# Altium schematic sheet WITH_MIC.SchDoc: ESP32 + INMP441 WLED SHIELD
size A; Revision: 1; SheetNumber: 1; SheetTotal: 2
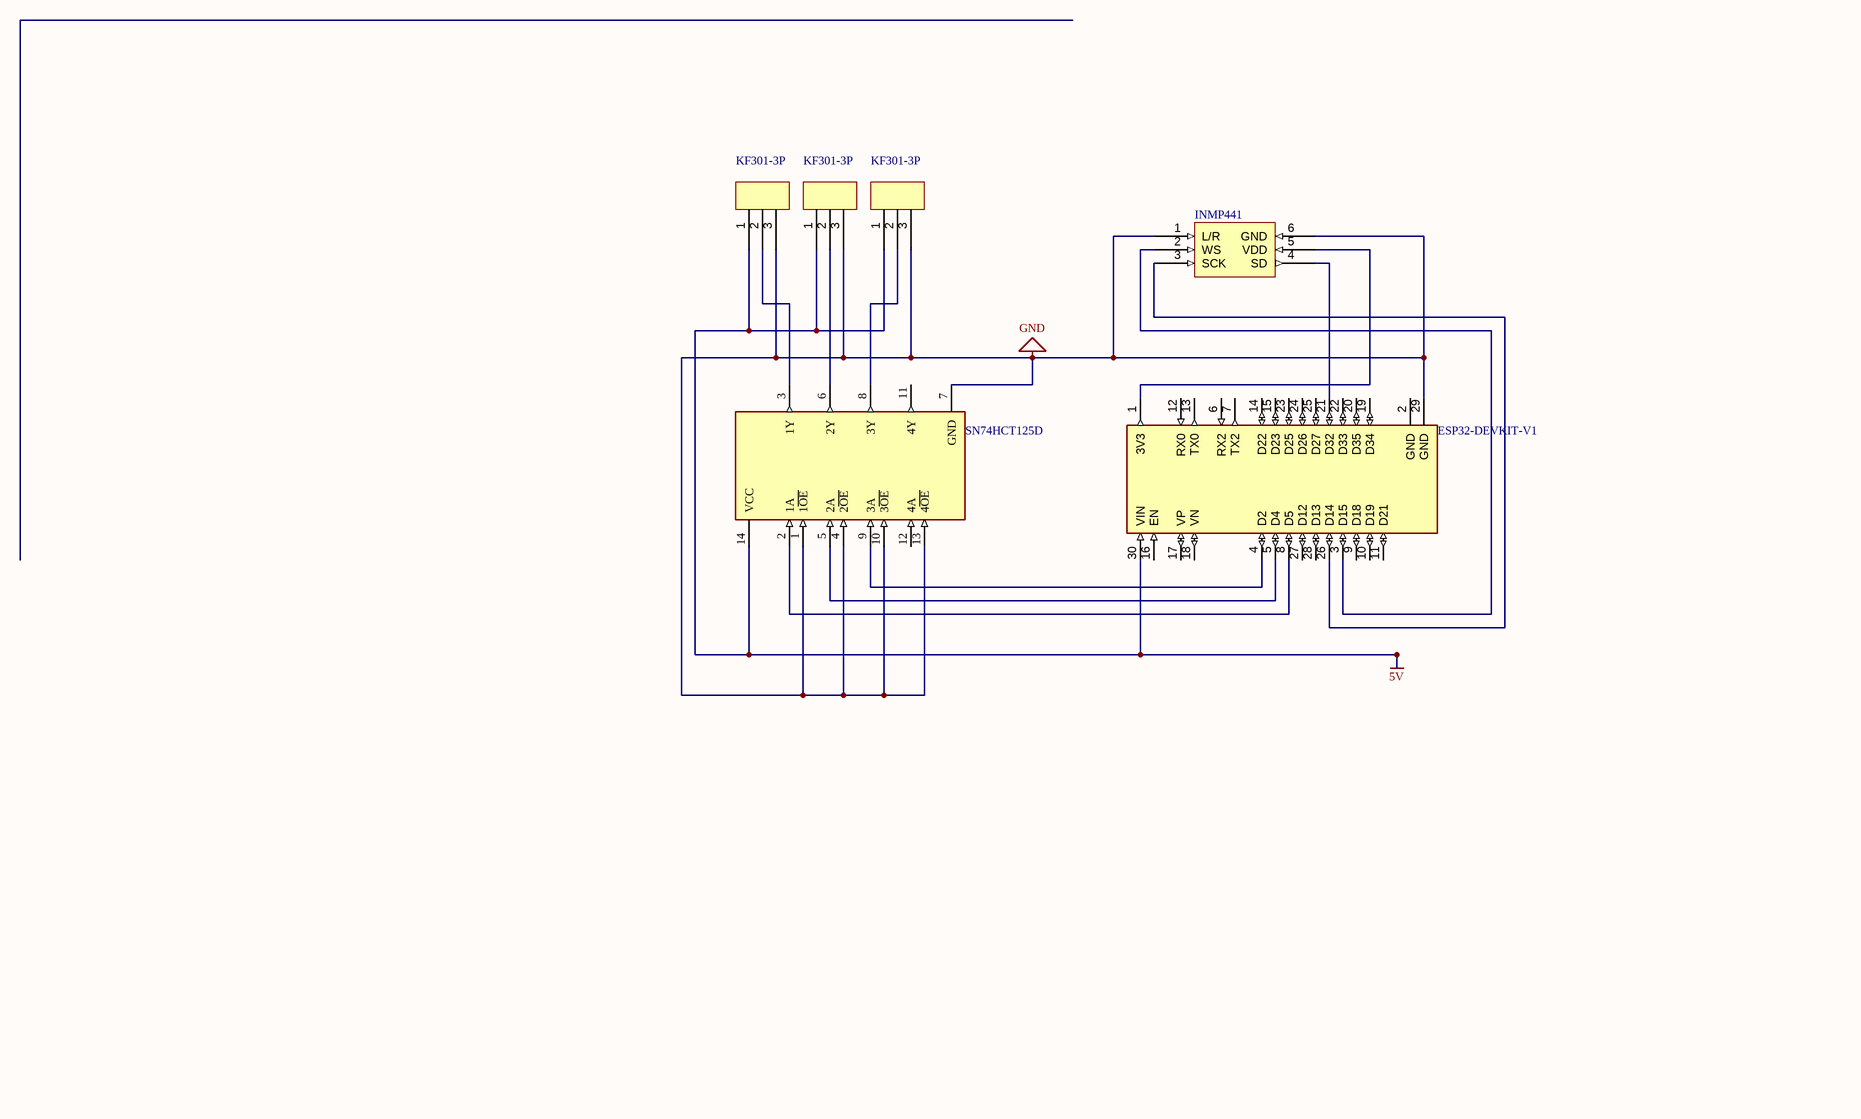
[diagram p0: WITH_MIC.SchDoc]

## Parts
(Parts that share a designator on the sheet are numbered #1, #2 ... from top to bottom, then left to right.)
ESP32-DEVKIT-V1  (no value)  [MODULE_ESP32_DEVKIT_V1]
INMP441  (no value)  (no BOM)
KF301-3P#1  (no value)  (no BOM)
KF301-3P#2  (no value)  (no BOM)
KF301-3P#3  (no value)  (no BOM)
SN74HCT125D  (no value)  [FP-D0014A-IPC_C]

## Nets
5V: ESP32-DEVKIT-V1.30(VIN) KF301-3P#1.1 KF301-3P#2.1 KF301-3P#3.1 SN74HCT125D.14(VCC)
GND: ESP32-DEVKIT-V1.29(GND) INMP441.1(L/R) INMP441.6(GND) KF301-3P#1.3 KF301-3P#2.3 KF301-3P#3.3 SN74HCT125D.1(1~{OE}) SN74HCT125D.4(2~{OE}) SN74HCT125D.7(GND) SN74HCT125D.10(3~{OE}) SN74HCT125D.13(4~{OE})
NetESP32-DEVKIT-V1_1: ESP32-DEVKIT-V1.1(3V3) INMP441.5(VDD)
NetESP32-DEVKIT-V1_3: ESP32-DEVKIT-V1.3(D15) INMP441.2(WS)
NetESP32-DEVKIT-V1_4: ESP32-DEVKIT-V1.4(D2) SN74HCT125D.9(3A)
NetESP32-DEVKIT-V1_5: ESP32-DEVKIT-V1.5(D4) SN74HCT125D.5(2A)
NetESP32-DEVKIT-V1_8: ESP32-DEVKIT-V1.8(D5) SN74HCT125D.2(1A)
NetESP32-DEVKIT-V1_21: ESP32-DEVKIT-V1.21(D32) INMP441.4(SD)
NetESP32-DEVKIT-V1_26: ESP32-DEVKIT-V1.26(D14) INMP441.3(SCK)
NetKF301-3P#1_2: KF301-3P#1.2 SN74HCT125D.3(1Y)
NetKF301-3P#2_2: KF301-3P#2.2 SN74HCT125D.6(2Y)
NetKF301-3P#3_2: KF301-3P#3.2 SN74HCT125D.8(3Y)

Not connected (* = marked no-connect by the designer): ESP32-DEVKIT-V1 2(GND) 6(RX2) 7(TX2) 9(D18) 10(D19) 11(D21) 12(RX0) 13(TX0) 14(D22) 15(D23) 16(EN) 17(VP) 18(VN) 19(D34) 20(D35) 22(D33) 23(D25) 24(D26) 25(D27) 27(D12) 28(D13); SN74HCT125D 11(4Y) 12(4A)

## Library data of the parts
ESP32-DEVKIT-V1 = ESP32-DEVKIT-V1: Dual core, Wi-Fi: 2.4 GHz up to 150 Mbits/s,BLE (Bluetooth Low Energy) and legacy Bluetooth, 32 bits, Up to 240 MHz; MF: Do it; Price: None; Availability: Not in stock; Package: None; MP: ESP32-DEVKIT-V1; Value: *; SnapEDA_Link: https://www.snapeda.com/parts/ESP32-DEVKIT-V1/Do+it/view-part/?ref=snap; Check_prices: https://www.snapeda.com/parts/ESP32-DEVKIT-V1/Do+it/view-part/?ref=eda
INMP441 = INMP441
KF301-3P#1-KF301-3P#3 = KF301-3P
SN74HCT125D = CMP-0440-00009-4: IC BUF NON-INVERT 5.5V 14SOIC; Number of Elements: 4; Logic Function: Buffer; Operating Supply Voltage: 5V; Quiescent Current: 8uA; Polarity: Non-Inverting; Min Supply Voltage: 4.5V; Output Current: 6mA; High Level Output Current: -6mA; Number of Bits per Element: 1; Propagation Delay: 50ns; Output Type: 3-STATE; Mount: Surface Mount; Max Operating Temperature: 85°C; Max Supply Voltage: 5.5V; Width: 3.91mm; REACH SVHC: No SVHC; Number of Input Lines: 4; Min Operating Temperature: -40°C; Length: 8.65mm; Number of Bits: 4; Height: 1.58mm; Number of Circuits: 4; Radiation Hardening: No; Packaging: Rail/Tube; Number of Outputs: 4; RoHS Compliant: Yes; Lead Free: Lead Free; Low Level Output Current: 6mA; Number of Channels: 4; Case/Package: SOIC; Number of Inputs: 4; Series: 74HCT; Number of Pins: 14; Technology: CMOS; Turn-On Delay Time: 50ns; Package Quantity: 50; Number of Output Lines: 4